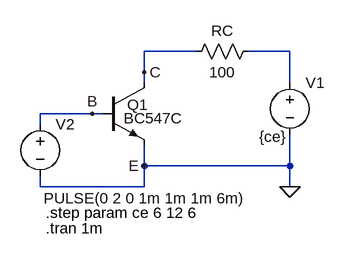
[diagram p0: schematic lab_1_2_2_a_Eingangangskennlinienfeld_VCEVar_solution.asc]
lab_1_2_2_a_Eingangangskennlinienfeld_VCEVar_solution.asc, the LTspice schematic file:
Version 4
SHEET 1 880 680
WIRE 288 48 208 48
WIRE 432 48 368 48
WIRE 208 80 208 48
WIRE 208 96 208 80
WIRE 432 96 432 48
WIRE 128 144 48 144
WIRE 144 144 128 144
WIRE 48 160 48 144
WIRE 208 224 208 192
WIRE 432 224 432 176
WIRE 432 224 208 224
WIRE 48 256 48 240
WIRE 208 256 208 224
WIRE 208 256 48 256
WIRE 432 256 432 224
FLAG 432 256 0
FLAG 128 144 B
FLAG 208 80 C
FLAG 208 224 E
SYMBOL npn 144 96 R0
WINDOW 0 38 34 Left 2
WINDOW 3 32 55 Left 2
SYMATTR InstName Q1
SYMATTR Value BC547C
SYMBOL voltage 432 80 R0
WINDOW 123 0 0 Left 0
WINDOW 39 0 0 Left 0
WINDOW 3 -47 99 Left 2
SYMATTR Value {ce}
SYMATTR InstName V1
SYMBOL res 384 32 R90
WINDOW 0 0 56 VBottom 2
WINDOW 3 32 56 VTop 2
SYMATTR InstName RC
SYMATTR Value 100
SYMBOL voltage 48 144 R0
WINDOW 3 5 130 Left 2
WINDOW 123 0 0 Left 0
WINDOW 39 0 0 Left 0
SYMATTR Value PULSE(0 2 0 1m 1m 1m 6m)
SYMATTR InstName V2
TEXT 56 296 Left 2 !.step param ce 6 12 6
TEXT 56 320 Left 2 !.tran 1m

The netlist it stands for:
* lab_1_2_2_a_Eingangangskennlinienfeld_VCEVar_solution.asc
Q1 C B 0 0 BC547C
V1 N001 0 {ce}
RC N001 C 100
V2 B 0 PULSE(0 2 0 1m 1m 1m 6m)
.model NPN NPN
.model PNP PNP
.lib standard.bjt
.step param ce 6 12 6
.tran 1m
.backanno
.end